# EAGLE design arm-pro-mini (EAGLE 6.5.0)
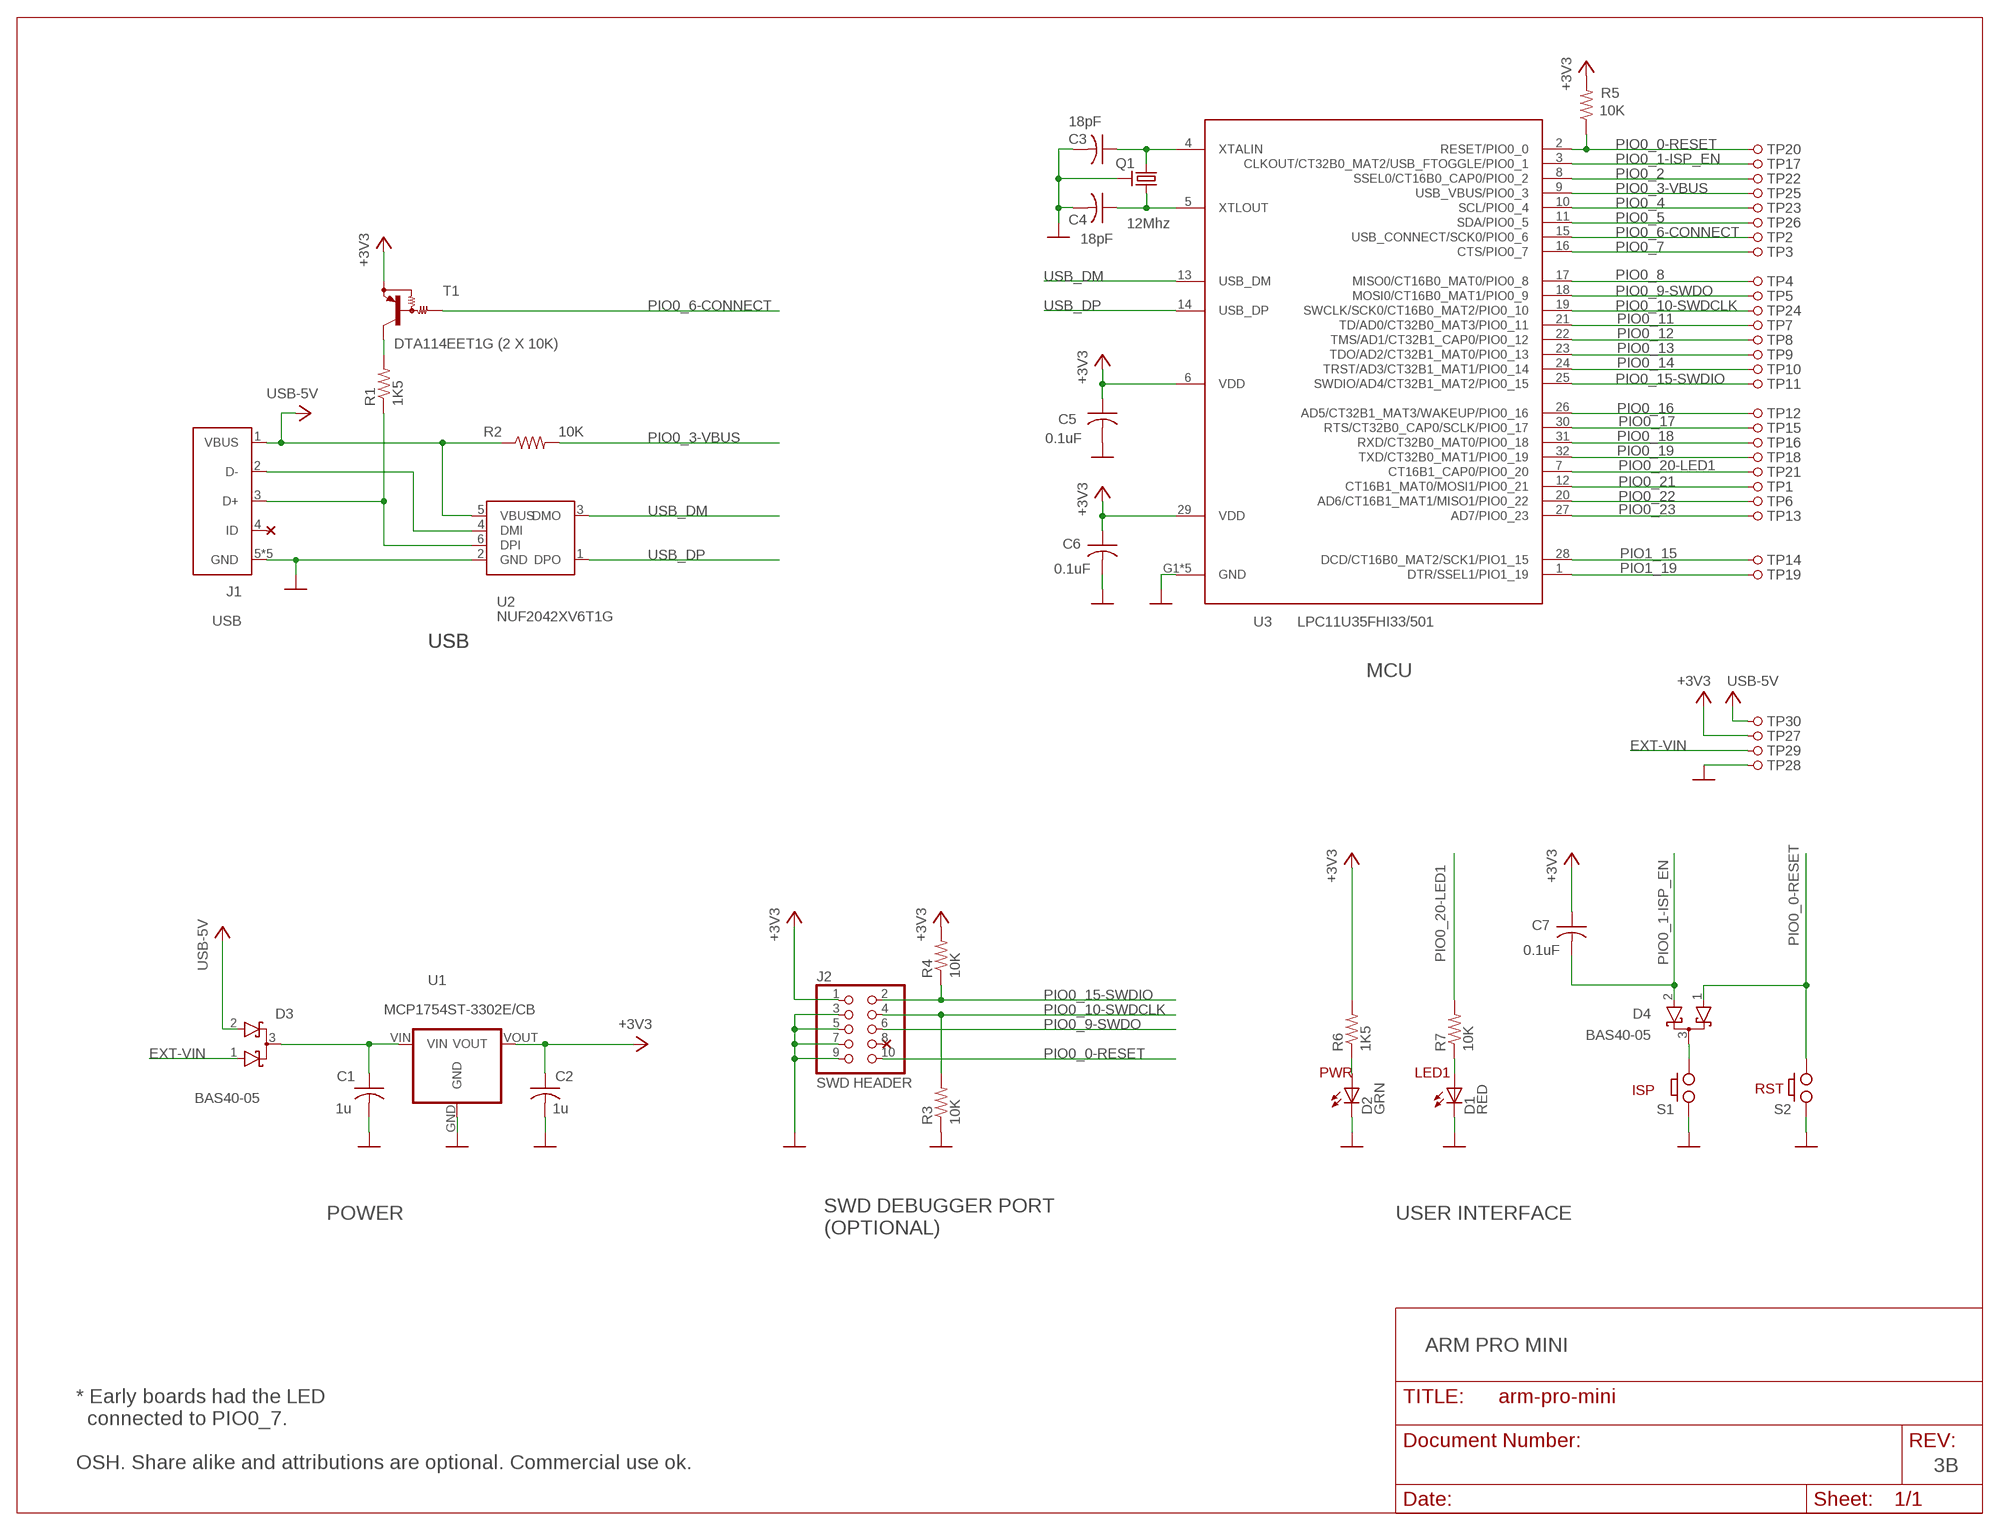
[diagram p0: schematic, sheet 1]

## Parts
C1  1u  CAPACITORC0603K  [C0603K]
C2  1u  CAPACITORC0603K  [C0603K]
C3  18pF  C-USC0402K  [C0402K]
C4  18pF  C-USC0402K  [C0402K]
C5  0.1uF  CAPACITORC0603K  [C0603K]
C6  0.1uF  CAPACITORC0603K  [C0603K]
C7  0.1uF  CAPACITORC0603K  [C0603K]
D1  RED  LED  [LED0603]
D2  GRN  LED  [LED0603]
D3  BAS40-05  [SOT23]
D4  BAS40-05  [SOT23]
J1  USB  [USB-MICRO]
J2  SWD HEADER  SWD-HEADER  [SWD-HEADER]
Q1  12Mhz  CRYSTALCTS406  [CRYSTAL]
R1  1K5  R-US_R0402  [R0402]
R2  10K  R-US_R0402  [R0402]
R3  10K  R-US_R0402  [R0402]
R4  10K  R-US_R0402  [R0402]
R5  10K  R-US_R0402  [R0402]
R6  1K5  R-US_R0402  [R0402]
R7  10K  R-US_R0402  [R0402]
S1  PUSH_BUTTON  [PUSH_BUTTON]
S2  PUSH_BUTTON  [PUSH_BUTTON]
T1  DTA114EET1G (2 X 10K)  PNP_RESISTORS  [SC75-BEC]
TP1  HDR1  PINHD-1X1  [1X01]
TP2  HDR1  PINHD-1X1  [1X01]
TP3  HDR1  PINHD-1X1  [1X01]
TP4  HDR1  PINHD-1X1  [1X01]
TP5  HDR1  PINHD-1X1  [1X01]
TP6  HDR1  PINHD-1X1  [1X01]
TP7  HDR1  PINHD-1X1  [1X01]
TP8  HDR1  PINHD-1X1  [1X01]
TP9  HDR1  PINHD-1X1  [1X01]
TP10  HDR1  PINHD-1X1  [1X01]
TP11  HDR1  PINHD-1X1  [1X01]
TP12  HDR1  PINHD-1X1  [1X01]
TP13  HDR1  PINHD-1X1  [1X01]
TP14  HDR1  PINHD-1X1  [1X01]
TP15  HDR1  PINHD-1X1  [1X01]
TP16  HDR1  PINHD-1X1  [1X01]
TP17  HDR1  PINHD-1X1  [1X01]
TP18  HDR1  PINHD-1X1  [1X01]
TP19  HDR1  PINHD-1X1  [1X01]
TP20  HDR1  PINHD-1X1  [1X01]
TP21  HDR1  PINHD-1X1  [1X01]
TP22  HDR1  PINHD-1X1  [1X01]
TP23  HDR1  PINHD-1X1  [1X01]
TP24  HDR1  PINHD-1X1  [1X01]
TP25  HDR1  PINHD-1X1  [1X01]
TP26  HDR1  PINHD-1X1  [1X01]
TP27  HDR1  PINHD-1X1  [1X01]
TP28  HDR1  PINHD-1X1  [1X01]
TP29  HDR1  PINHD-1X1  [1X01]
TP30  HDR1  PINHD-1X1  [1X01]
U1  MCP1754ST-3302E/CB  LDO  [SOT-23A]
U2  NUF2042XV6T1G  USB_FILTER  [SOT-563]
U3  LPC11U35FHI33/501  LPC11U35FHN33/501  [HVQFN33-5MM]

## Nets
+3V3: C2.1 C5.1 C6.1 C7.1 J2.1 R4.2 R5.2 R6.2 T1.E TP27.1 U1.VOUT U3.6(VDD) U3.29(VDD)
EXT-VIN: D3.1(A1) TP29.1
GND: C1.2 C2.2 C3.2 C4.2 C5.2 C6.2 D1.C D2.C J1.5(GND) J1.G1(GND) J1.G2(GND) J1.G3(GND) J1.G4(GND) J2.3 J2.5 J2.7 J2.9 Q1.2(GND) Q1.4(GND) R3.1 S1.A1 S1.A1P S2.A1 S2.A1P TP28.1 U1.GND U2.2(GND) U3.G1(GND) U3.G2(GND) U3.G3(GND) U3.G4(GND) U3.TAB(GND)
N$1: C3.1 Q1.3 U3.4(XTALIN)
N$2: D2.A R6.1
N$3: C4.1 Q1.1 U3.5(XTLOUT)
N$4 [critical]: J1.2(D-) U2.4(DMI)
N$5: R1.2 T1.C
N$6: D1.A R7.1
N$7 [critical]: J1.3(D+) R1.1 U2.6(DPI)
N$8: D4.3(C) S1.B2 S1.B2P
N$10: C1.1 D3.3(C) U1.VIN
PIO0_0-RESET: D4.1(A1) J2.10 R5.1 S2.B2 S2.B2P TP20.1 U3.2(RESET/PIO0_0)
PIO0_1-ISP_EN: C7.2 D4.2(A2) TP17.1 U3.3(CLKOUT/CT32B0_MAT2/USB_FTOGGLE/PIO0_1)
PIO0_2: TP22.1 U3.8(SSEL0/CT16B0_CAP0/PIO0_2)
PIO0_3-VBUS: R2.2 TP25.1 U3.9(USB_VBUS/PIO0_3)
PIO0_4: TP23.1 U3.10(SCL/PIO0_4)
PIO0_5: TP26.1 U3.11(SDA/PIO0_5)
PIO0_6-CONNECT: T1.B TP2.1 U3.15(USB_CONNECT/SCK0/PIO0_6)
PIO0_7: TP3.1 U3.16(CTS/PIO0_7)
PIO0_8: TP4.1 U3.17(MISO0/CT16B0_MAT0/PIO0_8)
PIO0_9-SWDO: J2.6 TP5.1 U3.18(MOSI0/CT16B0_MAT1/PIO0_9)
PIO0_10-SWDCLK: J2.4 R3.2 TP24.1 U3.19(SWCLK/SCK0/CT16B0_MAT2/PIO0_10)
PIO0_11: TP7.1 U3.21(TD/AD0/CT32B0_MAT3/PIO0_11)
PIO0_12: TP8.1 U3.22(TMS/AD1/CT32B1_CAP0/PIO0_12)
PIO0_13: TP9.1 U3.23(TDO/AD2/CT32B1_MAT0/PIO0_13)
PIO0_14: TP10.1 U3.24(TRST/AD3/CT32B1_MAT1/PIO0_14)
PIO0_15-SWDIO: J2.2 R4.1 TP11.1 U3.25(SWDIO/AD4/CT32B1_MAT2/PIO0_15)
PIO0_16: TP12.1 U3.26(AD5/CT32B1_MAT3/WAKEUP/PIO0_16)
PIO0_17: TP15.1 U3.30(RTS/CT32B0_CAP0/SCLK/PIO0_17)
PIO0_18: TP16.1 U3.31(RXD/CT32B0_MAT0/PIO0_18)
PIO0_19: TP18.1 U3.32(TXD/CT32B0_MAT1/PIO0_19)
PIO0_20-LED1: R7.2 TP21.1 U3.7(CT16B1_CAP0/PIO0_20)
PIO0_21: TP1.1 U3.12(CT16B1_MAT0/MOSI1/PIO0_21)
PIO0_22: TP6.1 U3.20(AD6/CT16B1_MAT1/MISO1/PIO0_22)
PIO0_23: TP13.1 U3.27(AD7/PIO0_23)
PIO1_15: TP14.1 U3.28(DCD/CT16B0_MAT2/SCK1/PIO1_15)
PIO1_19: TP19.1 U3.1(DTR/SSEL1/PIO1_19)
USB-5V: D3.2(A2) J1.1(VBUS) R2.1 TP30.1 U2.5(VBUS)
USB_DM [critical]: U2.3(DMO) U3.13(USB_DM)
USB_DP [critical]: U2.1(DPO) U3.14(USB_DP)
Unconnected: J1.4(ID) J2.8

## Notes on the sheet
- USB | USB
- MCU
- PWR | LED1
- ISP | RST
- POWER | USER INTERFACE
- SWD DEBUGGER PORT
  (OPTIONAL)
- ARM PRO MINI
- * Early boards had the LED
    connected to PIO0_7.
- OSH. Share alike and attributions are optional. Commercial use ok. | 3B

## Library data of the parts
C1 C2 C5-C7 = arm-pro-mini:CAPACITOR: CAPACITOR, American symbol
C3 C4 = arm-pro-mini:C-US: CAPACITOR, American symbol
D1 D2 = arm-pro-mini:LED
D3 D4 = arm-pro-mini:BAS40-05: Silicon Schottky Diodes General-purpose diode for high-speed switching
J1 = arm-pro-mini:USB
J2 = arm-pro-mini:SWD-HEADER: PIN HEADER
Q1 = arm-pro-mini:CRYSTAL: CRYSTAL; OC_FARNELL: unknown; OC_NEWARK: unknown
R1-R7 = arm-pro-mini:R-US_: RESISTOR, American symbol
S1 S2 = arm-pro-mini:PUSH_BUTTON: CKN10502CT-ND
T1 = arm-pro-mini:PNP_RESISTORS: DTA114EET1G (Digikey DTA114EET1GOSCT-ND)
TP1-TP30 = arm-pro-mini:PINHD-1X1: PIN HEADER
U1 = arm-pro-mini:LDO
U2 = arm-pro-mini:USB_FILTER
U3 = arm-pro-mini:LPC11U35FHN33/501

## Net classes
1 power: width 0.254 mm

## Board
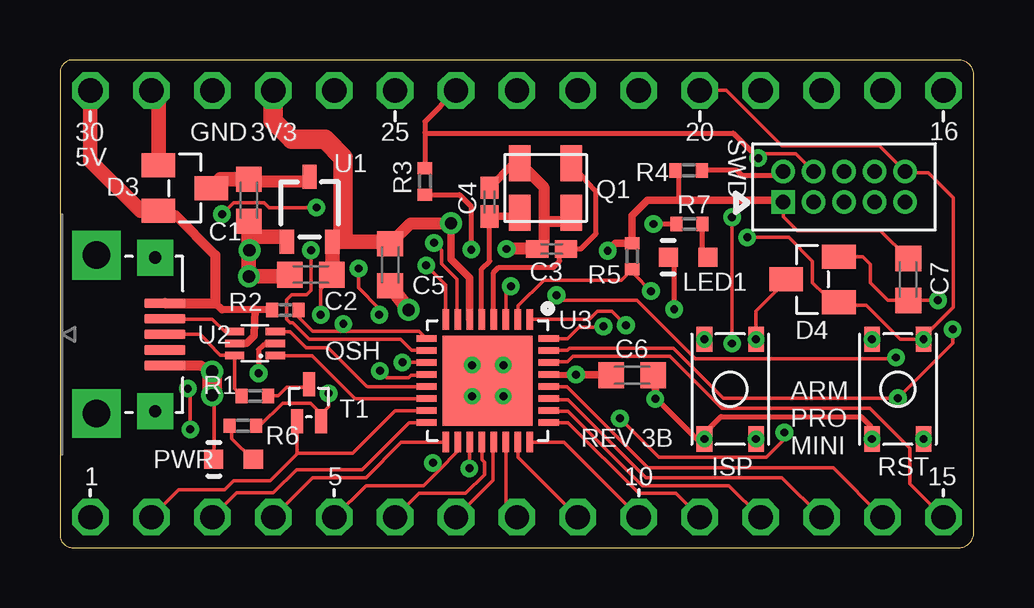
[diagram p1: board, top side]
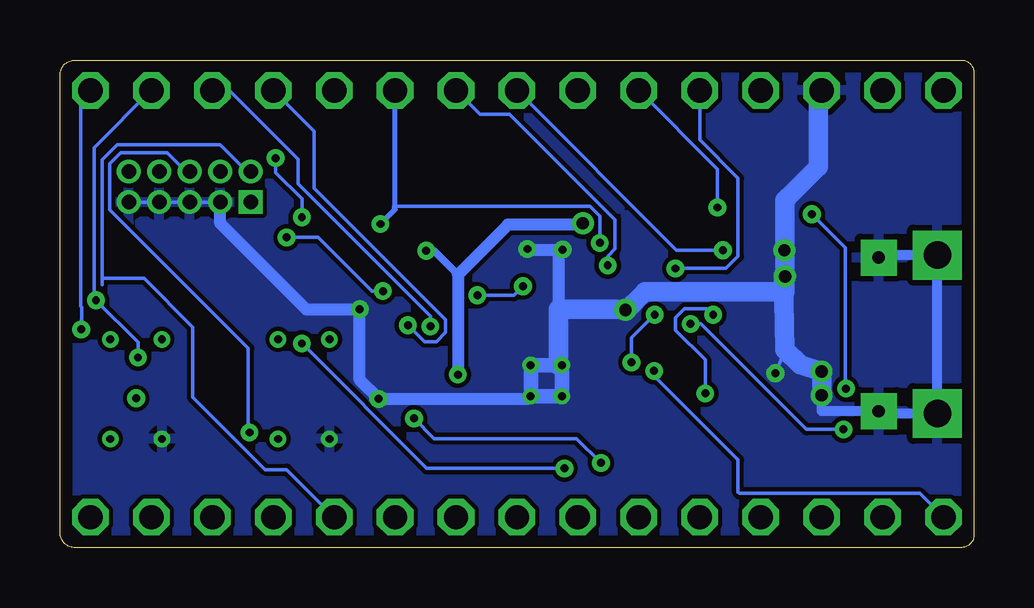
[diagram p2: board, bottom side, seen from below]

Size 38.1 x 20.32 mm. Coordinates in mm from the lower left corner, seen from the top.
Outline: 38.1,0.64 38.1,19.68 arc90 37.47,20.32 0.54,20.32 arc90 0,19.78 0,0.54 arc90 0.54,0 37.47,0 arc90 38.1,0.64
Copper layers (1*16): Top 0.035mm / dielectric 1.5mm / Bottom 0.035mm
Design rules "default *": minimum track width 6mil, minimum drill 13mil, track to track 7mil, track to pad 6mil, pad to pad 6mil, via to via 8mil, smd to smd 0mil, copper to edge 20mil, drill to drill 8mil, minimum pad ring 7mil, minimum via ring 8mil, stop-mask expansion 4mil, vias tented up to drill 20mil, thermal gap 10mil

### Footprints (pad centres in the part's own frame; a part is rotated, then mirrored left to right if it is on the bottom)
C0603K = smd 1.05 x 1.08: 1 -0.875,0; 2 0.875,0
C0402K = smd 0.925 x 0.74: 1 -0.6,0; 2 0.6,0
LED0603 = smd 0.8 x 0.8: A 0,-0.825; C 0,0.825
SOT23 = smd 1 x 1.4: 1 -0.95,-1.1; 2 0.95,-1.1; 3 0,1.1
USB-MICRO = smd 0.4 x 1.7: 1 -1.3,2.85; 2 -0.65,2.85; 3 0,2.85; 4 0.65,2.85; 5 1.3,2.85 | drill 1.143 pad 2.032 square: G1 -3.3,0; G2 3.3,0 | drill 0.508 pad 1.5 square: G3 -3.2,2.45; G4 3.2,2.45
SWD-HEADER = drill 0.6 pad 0.991 square: 1 -2.54,-0.635 | drill 0.6 pad 0.991: 2 -2.54,0.635; 3 -1.27,-0.635; 4 -1.27,0.635; 5 0,-0.635; 6 0,0.635; 7 1.27,-0.635; 8 1.27,0.635; 9 2.54,-0.635; 10 2.54,0.635
CRYSTAL = smd 0.9 x 1.5: 1 -1.075,-1.025; 2 1.075,-1.025; 3 1.075,1.025; 4 -1.075,1.025
R0402 = smd 0.5 x 0.6: 1 -0.55,0; 2 0.55,0
PUSH_BUTTON = smd 1.05 x 0.65: A1 -2.075,1.075; A2 2.075,1.075; B1 -2.075,-1.075; B2 2.075,-1.075 | drill 0.33 pad 0.61: A1P -2.075,1.075; A2P 2.075,1.075; B1P -2.075,-1.075; B2P 2.075,-1.075
SC75-BEC = smd 0.5 x 1: B -0.5,-0.771; C 0,0.771; E 0.5,-0.771
1X01 = drill 1.016 octagon: 1 0,0
SOT-23A = smd 0.6 x 1: GND -0.95,-1.35; VIN 0,1.35; VOUT 0.95,-1.35
SOT-563 = smd 0.3 x 0.8: 1 -0.5,-0.85; 2 0,-0.85; 3 0.5,-0.85; 4 0.5,0.85; 5 0,0.85; 6 -0.5,0.85
HVQFN33-5MM = smd 0.85 x 0.27: 1 -2.55,1.75; 2 -2.55,1.25; 3 -2.55,0.75; 4 -2.55,0.25; 5 -2.55,-0.25; 6 -2.55,-0.75; 7 -2.55,-1.25; 8 -2.55,-1.75; 17 2.55,-1.75; 18 2.55,-1.25; 19 2.55,-0.75; 20 2.55,-0.25; 21 2.55,0.25; 22 2.55,0.75; 23 2.55,1.25; 24 2.55,1.75 | smd 0.27 x 0.85: 9 -1.75,-2.55; 10 -1.25,-2.55; 11 -0.75,-2.55; 12 -0.25,-2.55; 13 0.25,-2.55; 14 0.75,-2.55; 15 1.25,-2.55; 16 1.75,-2.55; 25 1.75,2.55; 26 1.25,2.55; 27 0.75,2.55; 28 0.25,2.55; 29 -0.25,2.55; 30 -0.75,2.55; 31 -1.25,2.55; 32 -1.75,2.55 | drill 0.33 pad 0.6: G1 -0.65,0.65; G2 -0.65,-0.65; G3 0.65,-0.65; G4 0.65,0.65 | smd 3.75 x 3.75: TAB 0,0

### Placement (x,y rotation side)
C1  7.87,14.48 270 top
C2  10.46,11.38 180 top
C3  20.5,12.45 180 top
C4  17.91,14.4 90 top
C5  13.77,11.79 270 top
C6  23.85,7.19 0 top
C7  35.36,11.18 270 top
D1  26.19,12.1 90 top
D2  7.23,3.68 90 top
D3  5.21,14.99 270 top
D4  31.37,11.18 90 top
J1  1.52,8.89 270 top
J2  32.69,15.04 0 top
Q1  20.24,14.99 0 top
R1  8.13,6.32 0 top
R2  9.4,9.91 0 top
R3  15.21,15.27 90 top
R4  26.21,15.72 180 top
R5  23.85,12.14 90 top
R6  7.62,5.08 0 top
R7  26.24,13.49 180 top
S1  27.94,6.6 90 top
S2  34.92,6.6 90 top
T1  10.38,6.05 0 top
TP1  1.27,1.27 90 top
TP2  3.81,1.27 0 top
TP3  6.35,1.27 0 top
TP4  8.89,1.27 0 top
TP5  11.43,1.27 0 top
TP6  13.97,1.27 0 top
TP7  16.51,1.27 0 top
TP8  19.05,1.27 0 top
TP9  21.59,1.27 0 top
TP10  24.13,1.27 0 top
TP11  26.67,1.27 0 top
TP12  29.21,1.27 0 top
TP13  31.75,1.27 0 top
TP14  34.29,1.27 0 top
TP15  36.83,1.27 0 top
TP16  36.83,19.05 0 top
TP17  34.29,19.05 0 top
TP18  31.75,19.05 0 top
TP19  29.21,19.05 0 top
TP20  26.67,19.05 0 top
TP21  24.13,19.05 0 top
TP22  21.59,19.05 0 top
TP23  19.05,19.05 0 top
TP24  16.51,19.05 0 top
TP25  13.97,19.05 0 top
TP26  11.43,19.05 0 top
TP27  8.89,19.05 0 top
TP28  6.35,19.05 0 top
TP29  3.81,19.05 0 top
TP30  1.27,19.05 0 top
U1  10.4,14.1 0 top
U2  8.13,8.51 90 top
U3  17.83,6.96 270 top

### Tracks (layer width: path | path; a pad name or v marks a point on that pad's centre or on a via)
+3V3  (via drill 0.33, 0.51)
  Top 0.152: 16.43,13.79 v16.31,13.51 | 10.87,5.56 T1.E | v10.87,9.7 10.87,10.77 11.2,11.1 C2.1 | 10.87,5.49 T1.E | 30.07,14.48 J2.1 30.15,13.79 30.73,13.21 34.2,13.21 C7.1 35.36,12.06 | T1.E 10.88,5.58 10.44,6.02 9.27,6.02 8.33,5.08 R6.2 | 10.95,5.51 T1.E | v11.2,6.43 11.2,5.87 10.88,5.54 T1.E
  Top 0.203: R4.2 25.78,15.6 25.78,14.48 | 26.06,14.48 26.16,14.48
  Top 0.254: 23.16,7.46 C6.1 | U3.29 v21.51,7.21
  Top 0.305: U3.6 17.08,11.24 16.31,12.01 v16.31,13.51 | 23.16,7.46 22.91,7.21 v21.51,7.21 | 30.07,14.48 26.16,14.48 26.11,14.48 | 26.06,14.48 25.78,14.48 24.49,14.48 23.85,13.83 R5.2 23.16,12.69 v22.84,12.37
  Top 0.508: v16.31,13.51 14.62,13.51 C5.1 13.46,12.7
  Top 0.61: v21.52,7.21 v21.51,7.21 | U1.VOUT 13.77,12.75 C5.1 | C2.1 11.35,11.38 U1.VOUT | U1.VOUT 11.81,12.75 11.81,13.08
  Top 0.813: TP27.1 8.89,17.78 9.65,17.02 11.05,17.02 11.81,16.26 11.81,13.08
  Bottom 0.152: 21.64,6.93 v21.51,7.21 | v11.2,6.43 11.2,7.82 12.45,9.07 12.45,9.58 12.06,9.96 11.12,9.96 v10.87,9.7
  Bottom 0.305: 21.51,11.38 22.5,12.37 v22.84,12.37
  Bottom 0.508: v16.31,13.51 16.36,13.46 19.43,13.46 21.51,11.38 v21.51,7.21
EXT-VIN
  Top 0.61: TP29.1 4.11,18.75 D3.1
GND  (via drill 0.33, 0.51)
  Top 0.152: U3.G2 U3.TAB | 15.21,14.71 R3.1 | D2.C 6.43,4.57 6.43,5.97 v6.35,6.35 | 24.94,6.12 v24.82,6.2 | 7.87,12.45 v7.9,12.39
  Top 0.203: C4.2 17.96,14.83 17.96,15.23 | Q1.2 21.23,13.59 | 20.19,12.74 C3.2 | 24.94,6.12 26.54,4.53 S1.A1P 26.86,4.77 27.56,5.46 33.4,5.46 33.78,5.08 33.78,4.6 S2.A1P 33.66,4.72 | R3.1 16.65,14.71 17.14,14.22 v17.14,12.42 | D1.C 25.6,11.86 v25.6,9.93 | U2.2 8.61,8.53 8.28,8.26 v8.28,7.26
  Top 0.254: 24.93,7.34 C6.2
  Top 0.305: 24.93,7.34 24.82,7.23 v24.82,6.2 | Q1.4 18.92,16.01 C4.2
  Top 0.406: v6.35,7.34 5.87,7.59 J1.5
  Top 0.457: 20.19,12.74 20.19,13.59 | 20.19,13.59 20.19,14.99 Q1.4 | 21.23,13.59 20.19,13.59
  Top 0.508: 9.45,11.51 C2.2 | C3.2 v18.62,12.45
  Top 0.61: v14.53,9.91 C5.2 | 7.76,13.72 C1.2 7.87,12.45 v7.87,11.3 9.51,11.3 C2.2 | U1.GND 9.45,12.95 7.9,12.95 v7.9,12.39
  Top 0.813: v6.35,7.34 v6.35,6.35
  Bottom 0.152: J2.3 J2.5 J2.7 J2.9 | v17.14,12.42 17.14,12.45 | 7.87,8.26 7.75,8.26 7.62,8.38 | v8.28,7.26 7.92,8.1 | 7.92,10.29 8,10.29 7.87,10.67 | 14.22,10.16 14.35,10.29 v14.53,9.91
  Bottom 0.254: 18.48,7.09 U3.G1
  Bottom 0.305: U3.G1 18.47,7.59
  Bottom 0.406: J1.G2 3.97,5.59 J1.G4 6.35,5.69 v6.35,6.35 | J1.G1 3.97,12.19 J1.G3 | J1.G2 | J1.G2 J1.G1 | J1.G1 | 7.75,14.61 7.75,14.35
  Bottom 0.508: TP28.1 6.48,18.92 | 7.87,12.42 v7.9,12.39 | v18.62,12.45 18.47,12.42 v17.14,12.42 17.32,12.24 17.32,9.93 | U3.G4 18.59,6.2 v24.82,6.2 25.6,6.99 v25.6,9.93 27.84,9.93 31.42,13.51 J2.3
  Bottom 0.61: U3.G2 U3.G3 U3.G4 | U3.G1 U3.G2 | 18.47,7.59 18.47,6.33 | 17.32,7.61 U3.G2 | 7.8,12.39 v7.9,12.39 | 7.87,11.35 v7.87,11.3
  Bottom 0.813: 17.32,7.61 17.32,9.93 14.91,9.93 v14.53,9.91 | v6.35,6.35 v6.35,7.34 7.24,7.62 7.87,8.26 7.92,10.29 7.95,11.38 | 6.48,18.92 6.48,15.88 7.75,14.61 7.87,14.48 7.87,11.35 | v7.87,11.3 7.87,10.67 13.72,10.67 14.22,10.16 14.48,9.91
  pour Bottom: 0,0 0,20.32 38.1,20.32 38.1,0
N$1
  Top 0.203: U3.4 18.08,11.48 18.29,11.68 20.57,11.68 20.83,11.94 20.83,12.43 C3.1 21.72,12.45 22.35,13.08 22.35,14.86 21.98,15.23 Q1.3
N$2
  Top 0.152: R6.1 7.16,4.99 7.16,4.55 8.03,3.68 D2.A
N$3
  Top 0.203: 17.83,13.6 C4.1 17.91,11.94 17.58,11.61 U3.5
  Top 0.254: 19.12,13.73 Q1.1
  Top 0.305: 19.12,13.73 19.05,13.8 C4.1
N$4
  Top 0.152: J1.2 4.32,9.53 6.35,9.53 6.86,9.02 7.26,9.02 U2.4
N$5
  Top 0.152: 10.36,6.71 T1.C 10.29,6.68 9.45,6.68 9.09,6.33 R1.2
N$6
  Top 0.203: D1.A 26.79,12.33 R7.1
N$7
  Top 0.152: U2.6 | U2.6 7.21,8.03 7.11,8.08 7.06,8.03 6.68,8.03 6.2,8.51 6.2,8.53 5.84,8.89 J1.3 5.38,8.89 | R1.1 7.28,6.63 U2.6
N$8
  Top 0.152: S1.B2P 29.01,8.69 29.01,9.86 30.25,11.1 D4.3
N$10
  Top 0.203: C1.1 7.97,15.45
  Top 0.406: C1.1 7.75,15.55
  Top 0.508: C1.1 8.13,15.24 10.16,15.24 U1.VIN
  Top 0.61: D3.3 6.32,14.97 6.7,15.35 C1.1
PIO0_0-RESET  (via drill 0.33)
  Top 0.152: 19.1,9.53 U3.2 | 19.1,9.6 U3.2 | TP20.1 27.79,19.05 30.1,16.74 34.16,16.74 J2.10 35.28,15.62 36.2,15.62 37.24,14.58 37.24,10.01 35.99,8.76 S2.B2P 35.97,8.69 35.03,8.69 33.6,10.11 32.54,10.11 D4.1 32.46,10.16 32.46,10.44 32.36,10.54 31.88,10.54 31.37,11.05 31.37,11.94 30.38,12.93 v28.65,12.93 | U3.2 19.1,9.68 19.1,10.08 20.17,11.15 23.41,11.15 R5.1 23.9,11.56 23.9,11.43 v24.64,10.69
  Bottom 0.152: v28.65,12.93 27.33,12.93 25.09,10.69 v24.64,10.69
PIO0_1-ISP_EN  (via drill 0.33)
  Top 0.152: 34.14,19.05 TP17.1 34.34,19 | U3.3 18.59,9.53 18.59,10.69 v18.8,10.9 | 32.49,12.04 D4.2 33.47,12.13 33.78,11.81 33.78,11.05 34.52,10.31 35.36,10.31 C7.2 35.41,10.31 v36.6,10.31 | v34.85,7.92 34.82,7.92 34.77,7.87 26.49,7.87 24.05,10.31 20.9,10.31 v20.7,10.52
  Bottom 0.152: v18.8,10.9 19.18,10.52 v20.7,10.52 | TP17.1 36.68,16.66 36.68,10.39 v36.6,10.31 34.85,8.56 v34.85,7.92
PIO0_2  (via drill 0.33)
  Top 0.152: v15.27,11.76 16.08,10.95 16.08,9.53 U3.8
  Bottom 0.152: v15.27,11.76 15.27,12.14 14.96,12.45 14.96,13.66 19.36,18.06 20.6,18.06 TP22.1
PIO0_3-VBUS  (via drill 0.33)
  Top 0.152: 15.27,8.71 U3.9 15.21,8.76 14.96,9.02 11.81,9.02 | 11.81,9.02 10.54,9.02 9.95,9.61 R2.2 | v11.81,9.32 11.81,9.02 | v5.44,4.93 5.44,6.76 v5.33,6.63 | v10.69,14.17 8.71,14.17 8.51,14.38 7.24,14.38 v6.76,13.89
  Bottom 0.152: v5.33,6.63 5.36,6.55 5.36,12.5 v6.76,13.89 | v10.69,14.17 10.69,15.77 TP25.1 | v11.81,9.32 11.38,9.32 6.99,4.93 v5.44,4.93
PIO0_4  (via drill 0.33)
  Top 0.152: 15.27,8.23 U3.10 15.19,8.23 14.66,8.23 14.2,8.69 10.39,8.69 9.7,9.37 9.6,9.37 9.45,9.53 9.45,10.34 9.65,10.54 10.29,10.54 10.46,10.72 v10.46,12.39
  Bottom 0.152: v10.46,12.39 12.39,12.39 TP23.1
PIO0_5  (via drill 0.33)
  Top 0.152: 15.27,7.72 U3.11 15.19,7.72 v14.28,7.72 | v13.31,9.7 13.31,9.96 12.45,10.82 v12.45,11.63
  Bottom 0.152: v14.28,7.72 14.28,8.74 v13.31,9.7 | v12.45,11.63 10.34,11.63 9.83,12.14 9.83,15.39 11.43,16.99 TP26.1
PIO0_6-CONNECT
  Top 0.152: T1.B 9.88,5.54 9.88,3.91 | TP2.1 4.95,2.41 6.86,2.41 7.24,2.79 8.76,2.79 9.88,3.91 | U3.15 13.96,5.71 12.19,3.94 9.91,3.94 9.88,3.91
PIO0_7
  Top 0.152: 6.4,1.27 TP3.1 7.37,2.29 8.89,2.29 9.86,3.25 12.6,3.25 14.55,5.21 15.27,5.21 U3.16
PIO0_8
  Top 0.152: TP4.1 10.54,2.92 12.75,2.92 14.22,4.39 16.08,4.39 U3.17
PIO0_9-SWDO  (via drill 0.33)
  Top 0.152: 15.82,3.25 15.16,2.59 12.75,2.59 TP5.1 | 15.82,3.25 16.56,3.99 16.56,4.39 U3.18 | v30.2,4.8 30.2,4.52 29.44,3.76 24.97,3.76 v23.34,5.38 | 15.82,3.25 v15.54,3.53
  Bottom 0.152: J2.6 32.84,15.67 33.63,16.46 35.56,16.46 36.02,16 36.02,14.07 30.25,8.31 30.25,4.85 v30.2,4.8 | v23.34,5.38 22.5,4.55 16.56,4.55 v15.54,3.53
PIO0_10-SWDCLK  (via drill 0.33)
  Top 0.152: v17.07,3.3 17.07,4.39 U3.19 | J2.4 30.68,16.41 29.11,16.41 v29.11,16.23 | v28.02,13.77 v28.02,8.51
  Top 0.203: 15.21,17.3 R3.2 | TP24.1 15.21,17.75 15.21,17.3 | v29.11,16.23 28.07,17.27 15.24,17.27 15.21,17.3
  Bottom 0.152: v17.07,3.3 22.81,3.3 v28.02,8.51 | v28.02,13.77 28.02,14.53 29.11,15.62 v29.11,16.23
PIO0_11
  Top 0.152: TP7.1 18.06,2.82 18.06,4.39 U3.21
PIO0_12
  Top 0.152: TP8.1 18.59,1.73 18.59,4.39 U3.22
PIO0_13
  Top 0.152: TP9.1 19.1,3.76 19.1,4.39 U3.23
PIO0_14
  Top 0.152: TP10.1 21.01,4.39 19.58,4.39 U3.24
PIO0_15-SWDIO
  Top 0.152: 20.4,5.21 U3.25 20.47,5.21 21.18,5.21 24.13,2.26 25.68,2.26 TP11.1 | J2.2 30.07,15.6
  Top 0.203: 30.07,15.6 29.97,15.49 28.45,15.49 28.22,15.72 R4.1
  Bottom 0.152: J2.2 30.3,15.67 31.42,16.79 35.71,16.79 36.35,16.15 36.35,11.23 | 36.35,10.95 36.35,11.23 | TP11.1 28.65,3.25 29.54,3.25 32.56,6.27 32.56,9.2 34.59,11.23 36.35,11.23
PIO0_16
  Top 0.152: 20.4,5.69 U3.26 20.47,5.69 21.18,5.69 24.28,2.59 27.89,2.59 TP12.1
PIO0_17
  Top 0.152: 20.4,7.72 U3.30 20.47,7.75 21.16,7.75 21.39,7.98 25.43,7.98 27.58,5.82 33.76,5.82 35.43,4.14 35.43,2.67 TP15.1
PIO0_18  (via drill 0.33)
  Top 0.152: U3.31 20.4,8.23 21.16,8.23 21.23,8.31 25.58,8.31 27.66,6.22 v34.92,6.22 37.21,8.51 v37.21,9.09
  Bottom 0.152: TP16.1 37.24,18.64 37.24,10.06 37.19,10.01 37.19,9.37 37.21,9.32 v37.21,9.09
PIO0_19  (via drill 0.33)
  Top 0.152: v22.66,9.22 22.63,9.2 21.64,9.2 21.16,8.71 20.4,8.71 U3.32
  Bottom 0.152: v22.66,9.22 22.66,9.65 28.17,15.16 28.17,16.18 31.04,19.05 TP18.1
PIO0_20-LED1  (via drill 0.33)
  Top 0.152: v15.6,12.7 15.9,12.39 15.9,11.84 16.56,11.18 16.56,9.53 U3.7
  Top 0.203: v24.74,13.49 R7.2
  Bottom 0.152: v15.6,12.7 15.6,13.82 16,14.22 24.19,14.22 24.19,14.03
  Bottom 0.203: v24.74,13.49 24.19,14.03 24.13,14.1 TP21.1
PIO0_21  (via drill 0.33)
  Top 0.152: v13.34,7.37 13.61,7.09 14.53,7.09 14.63,7.19 15.27,7.19 U3.12
  Bottom 0.152: TP1.1 2.26,2.26 9.78,2.26 9.83,2.31 9.83,3.66 13.34,7.16 v13.34,7.37
PIO0_22
  Top 0.152: 17.6,4.39 U3.20 17.6,4.32 17.6,3.66 17.7,3.56 17.7,3.05 16.92,2.26 14.96,2.26 TP6.1
PIO0_23
  Top 0.152: 20.4,6.2 U3.27 20.47,6.17 21.18,6.17 24.43,2.92 30.1,2.92 TP13.1
PIO1_15
  Top 0.152: 20.4,6.71 U3.28 20.47,6.71 21.13,6.71 24.51,3.33 32.23,3.33 TP14.1
PIO1_19  (via drill 0.33)
  Top 0.152: v23.6,9.27 23.01,9.86 22.4,9.86 22.07,9.53 19.58,9.53 U3.1
  Bottom 0.152: v23.6,9.27 22.91,8.59 22.4,8.59 22.02,8.97 22.02,9.5 27.51,14.99 27.51,17.35 TP19.1
USB-5V
  Top 0.305: 6.48,10.19 6.76,9.91 8.13,9.93 | 8.13,9.93 R2.1 | 8.13,9.93 8.1,8.84 7.77,8.51 U2.5
  Top 0.406: J1.1 6.48,10.19 6.48,12.19 4.83,13.84 4.3,13.84
  Top 0.61: TP30.1 1.27,16.13 3.36,14.04 D3.2 4.3,13.84
USB_DM
  Top 0.152: U3.13 12.85,6.71 12.78,6.73 11.18,8.33 10.26,8.33 9.6,8.99 8.99,8.99 U2.3
  Top 0.203: U3.13
USB_DP
  Top 0.152: U3.14 12.33,6.21 12.27,6.25 10.52,8 8.99,8 U2.1

### Text on the board
tPlace: 30 | GND | 3V3 | 25 | 20 | SWD | 16 | 5V | LED1 | OSH | REV 3B | ARM / PRO / MINI | 1 | PWR | 5 | 10 | ISP | RST | 15
Document: OSH. Share alike and attributions / are optional. Commercial use ok.